# Altium schematic sheet OutputPowerModule.SchDoc
size A4
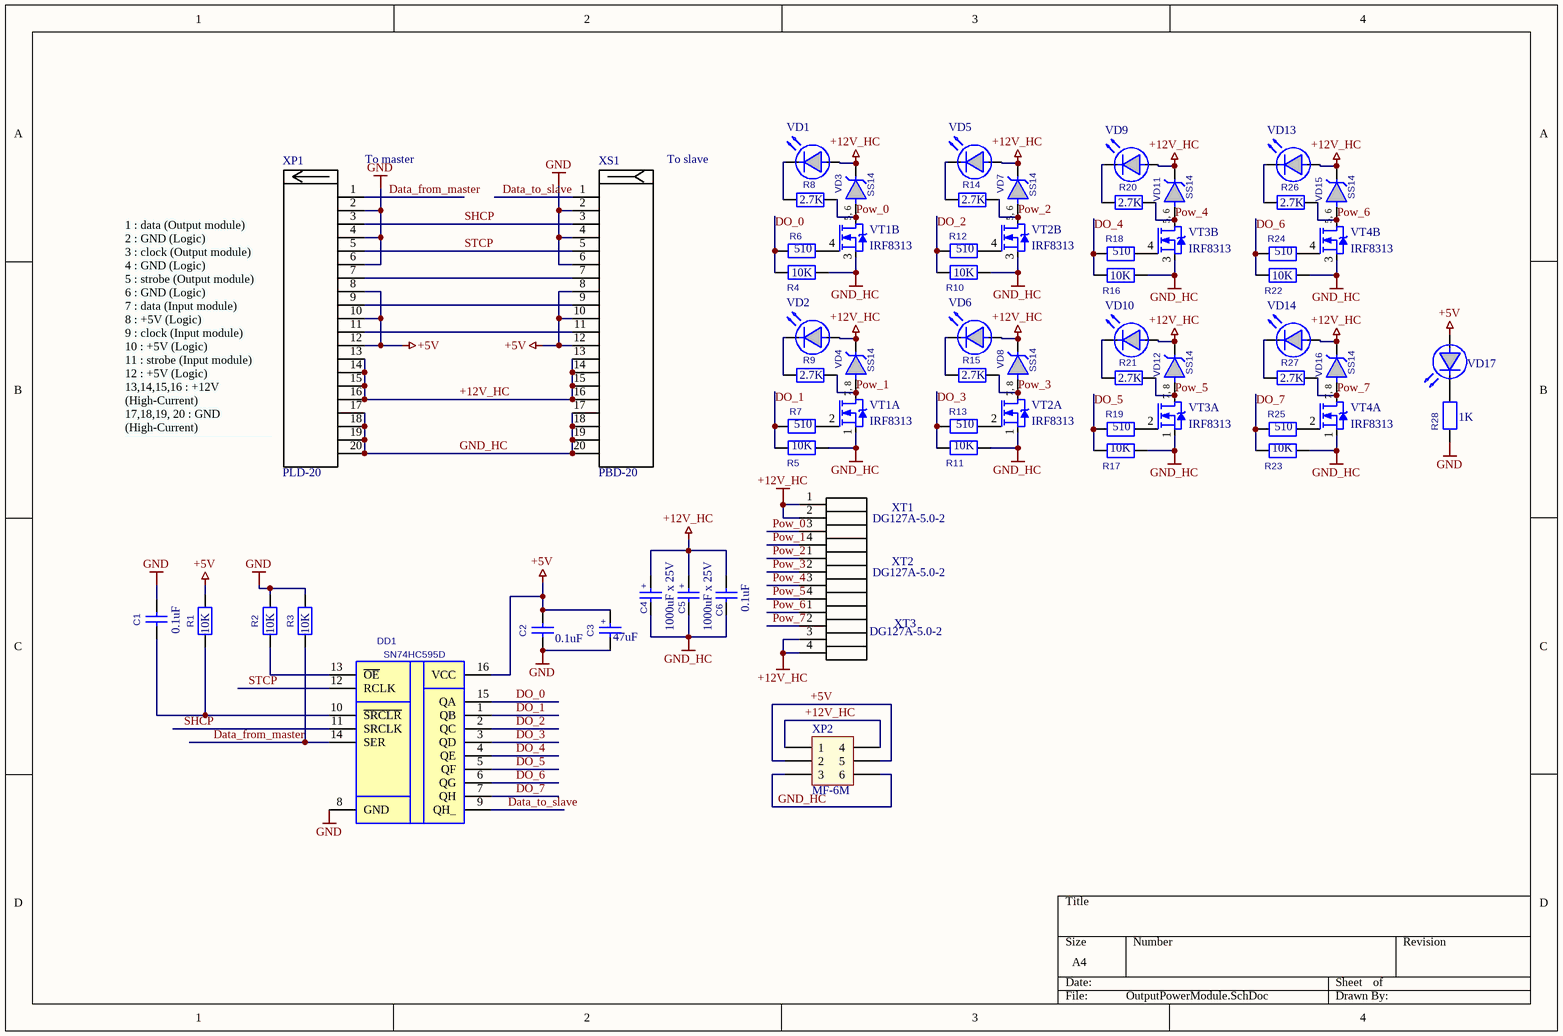
[diagram p0: OutputPowerModule.SchDoc]

## Parts
C1  0.1uF  [C-1608[0603]]
C2  0.1uF  [C-1608[0603]]
C3  47uF  [C-CASE]
C4  1000uF x 25V  [D10-5MM]
C5  1000uF x 25V  [D10-5MM]
C6  0.1uF  [C-1608[0603]]
DD1  SN74HC595D  [SO-G16]
R1  10K  [R-1608[0603]]
R2  10K  [R-1608[0603]]
R3  10K  [R-1608[0603]]
R4  10K  [R-1608[0603]]
R5  10K  [R-1608[0603]]
R6  510  [R-1608[0603]]
R7  510  [R-1608[0603]]
R8  2.7K  [R-1608[0603]]
R9  2.7K  [R-1608[0603]]
R10  10K  [R-1608[0603]]
R11  10K  [R-1608[0603]]
R12  510  [R-1608[0603]]
R13  510  [R-1608[0603]]
R14  2.7K  [R-1608[0603]]
R15  2.7K  [R-1608[0603]]
R16  10K  [R-1608[0603]]
R17  10K  [R-1608[0603]]
R18  510  [R-1608[0603]]
R19  510  [R-1608[0603]]
R20  2.7K  [R-1608[0603]]
R21  2.7K  [R-1608[0603]]
R22  10K  [R-1608[0603]]
R23  10K  [R-1608[0603]]
R24  510  [R-1608[0603]]
R25  510  [R-1608[0603]]
R26  2.7K  [R-1608[0603]]
R27  2.7K  [R-1608[0603]]
R28  1K  [R-1608[0603]]
VD1  L-C191KGCT  [LED-0603]  (value not drawn)
VD2  L-C191KGCT  [LED-0603]  (value not drawn)
VD3  SS14  [SMA]
VD4  SS14  [SMA]
VD5  L-C191KGCT  [LED-0603]  (value not drawn)
VD6  L-C191KGCT  [LED-0603]  (value not drawn)
VD7  SS14  [SMA]
VD8  SS14  [SMA]
VD9  L-C191KGCT  [LED-0603]  (value not drawn)
VD10  L-C191KGCT  [LED-0603]  (value not drawn)
VD11  SS14  [SMA]
VD12  SS14  [SMA]
VD13  L-C191KGCT  [LED-0603]  (value not drawn)
VD14  L-C191KGCT  [LED-0603]  (value not drawn)
VD15  SS14  [SMA]
VD16  SS14  [SMA]
VD17  L-C191KGCT  [LED-0603]  (value not drawn)
VT1  IRF8313  [SO8]  (parts A,B of 2)
VT2  IRF8313  [SO8]  (parts A,B of 2)
VT3  IRF8313  [SO8]  (parts A,B of 2)
VT4  IRF8313  [SO8]  (parts A,B of 2)
XP1  PLD-20  [PLD-20 ROT]
XP2  MF-6M  [MF-6M]
XS1  PBD-20  [PBD-20 Rot]
XT1  DG127A-5.0-2  [DG127A-5.0-2]
XT2  DG127A-5.0-2  [DG127A-5.0-2]
XT3  DG127A-5.0-2  [DG127A-5.0-2]

## Nets
+5V: C2.1 C3.1(+) DD1.16(VCC) R1.2 VD17.2(A) XP1.8 XP1.10 XP1.12 XP2.2 XP2.5 XS1.8 XS1.10 XS1.12
+12V_HC: C4.1(+) C5.1(+) C6.1 VD1.2(A) VD2.2(A) VD3.1(K) VD4.1(K) VD5.2(A) VD6.2(A) VD7.1(K) VD8.1(K) VD9.2(A) VD10.2(A) VD11.1(K) VD12.1(K) VD13.2(A) VD14.2(A) VD15.1(K) VD16.1(K) XP1.13 XP1.14 XP1.15 XP1.16 XP2.1 XP2.4 XS1.13 XS1.14 XS1.15 XS1.16 XT1.1 XT1.2 XT3.3 XT3.4
GND: C1.1 C2.2 C3.2(-) DD1.8(GND) R2.2 R3.2 R28.2 XP1.2 XP1.4 XP1.6 XS1.2 XS1.4 XS1.6
GND_HC: C4.2(-) C5.2(-) C6.2 R4.2 R5.2 R10.2 R11.2 R16.2 R17.2 R22.2 R23.2 VT1.1(S) VT1.3(S) VT2.1(S) VT2.3(S) VT3.1(S) VT3.3(S) VT4.1(S) VT4.3(S) XP1.17 XP1.18 XP1.19 XP1.20 XP2.3 XP2.6 XS1.17 XS1.18 XS1.19 XS1.20
Data_from_master: DD1.14(SER) R3.1 XP1.1
Data_to_slave: DD1.9(QH_) XS1.1
DO_0: DD1.15(QA) R4.1 R6.2
DO_1: DD1.1(QB) R5.1 R7.2
DO_2: DD1.2(QC) R10.1 R12.2
DO_3: DD1.3(QD) R11.1 R13.2
DO_4: DD1.4(QE) R16.1 R18.2
DO_5: DD1.5(QF) R17.1 R19.2
DO_6: DD1.6(QG) R22.1 R24.2
DO_7: DD1.7(QH) R23.1 R25.2
Pow_0: R8.2 VD3.2(A) VT1.5(D) VT1.6(D) XT1.3
Pow_1: R9.2 VD4.2(A) VT1.7(D) VT1.8(D) XT1.4
Pow_2: R14.2 VD7.2(A) VT2.5(D) VT2.6(D) XT2.1
Pow_3: R15.2 VD8.2(A) VT2.7(D) VT2.8(D) XT2.2
Pow_4: R20.2 VD11.2(A) VT3.5(D) VT3.6(D) XT2.3
Pow_5: R21.2 VD12.2(A) VT3.7(D) VT3.8(D) XT2.4
Pow_6: R26.2 VD15.2(A) VT4.5(D) VT4.6(D) XT3.1
Pow_7: R27.2 VD16.2(A) VT4.7(D) VT4.8(D) XT3.2
SHCP: DD1.11(SRCLK) XP1.3 XS1.3
STCP: DD1.12(RCLK) XP1.5 XS1.5
NetC1_2: C1.2 DD1.10(~{SRCLR}) R1.1
NetDD1_13: DD1.13(~{OE}) R2.1
NetR6_1: R6.1 VT1.4(G)
NetR7_1: R7.1 VT1.2(G)
NetR8_1: R8.1 VD1.1(K)
NetR9_1: R9.1 VD2.1(K)
NetR12_1: R12.1 VT2.4(G)
NetR13_1: R13.1 VT2.2(G)
NetR14_1: R14.1 VD5.1(K)
NetR15_1: R15.1 VD6.1(K)
NetR18_1: R18.1 VT3.4(G)
NetR19_1: R19.1 VT3.2(G)
NetR20_1: R20.1 VD9.1(K)
NetR21_1: R21.1 VD10.1(K)
NetR24_1: R24.1 VT4.4(G)
NetR25_1: R25.1 VT4.2(G)
NetR26_1: R26.1 VD13.1(K)
NetR27_1: R27.1 VD14.1(K)
NetR28_1: R28.1 VD17.1(K)
NetXP1_7: XP1.7 XS1.7
NetXP1_9: XP1.9 XS1.9
NetXP1_11: XP1.11 XS1.11

## Notes on the sheet
- (near XP1) To master
- (near XS1) To slave
- 1 : data (Output module)
  2 : GND (Logic)
  3 : clock (Output module)
  4 : GND (Logic)
  5 : strobe (Output module)
  6 : GND (Logic)
  7 : data (Input module)
  8 : +5V (Logic)
  9 : clock (Input module)
  10 : +5V (Logic)
  11 : strobe (Input module)
  12 : +5V (Logic)
  13,14,15,16 : +12V (High-Current)
  17,18,19, 20 : GND (High-Current)
- (in symbol IRF8313, part A) 7, 8
- (in symbol IRF8313, part B) 5, 6

## Library data of the parts
C1 C2 C6 = C-0603: Value: 0.1uF
C3 = C-CCASE: Value: 47uF
C4 C5 = K50-35(D10MM): Value: 1000uF x 25V
R1-R28 = R-0603
  R1-R5 R10 R11 R16 R17 R22 R23: Value: 10K
  R6 R7 R12 R13 R18 R19 R24 R25: Value: 510
  R8 R9 R14 R15 R20 R21 R26 R27: Value: 2.7K
  R28: Value: 1K
VD1 VD2 VD5 VD6 VD9 VD10 VD13 VD14 VD17 = L-C191KGCT: 0603 Green Led
VD3 VD4 VD7 VD8 VD11 VD12 VD15 VD16 = SS16: Value: SS14
VT1-VT4 = IRF8313: HEXFET Power MOSFET N channel
XP1 = PLD-20: 20 pin, 2 row, MALE connector
XP2 = MF-6M: Molex Male connector
XS1 = PBD-20: 2.54mm, 20 pin FEMALE connector
XT1-XT3 = DG127A-5.0-2: Клеммник винтовой двухрядный шаг 5.0 мм 2х2 контактов
DD1 = SN74HC595D: Value: *